# EAGLE design stm32-2inch40 (EAGLE 6.6.0)
40 pin mesonine module. 2 inch beetween pinheads.

## Sheet 1 of 2
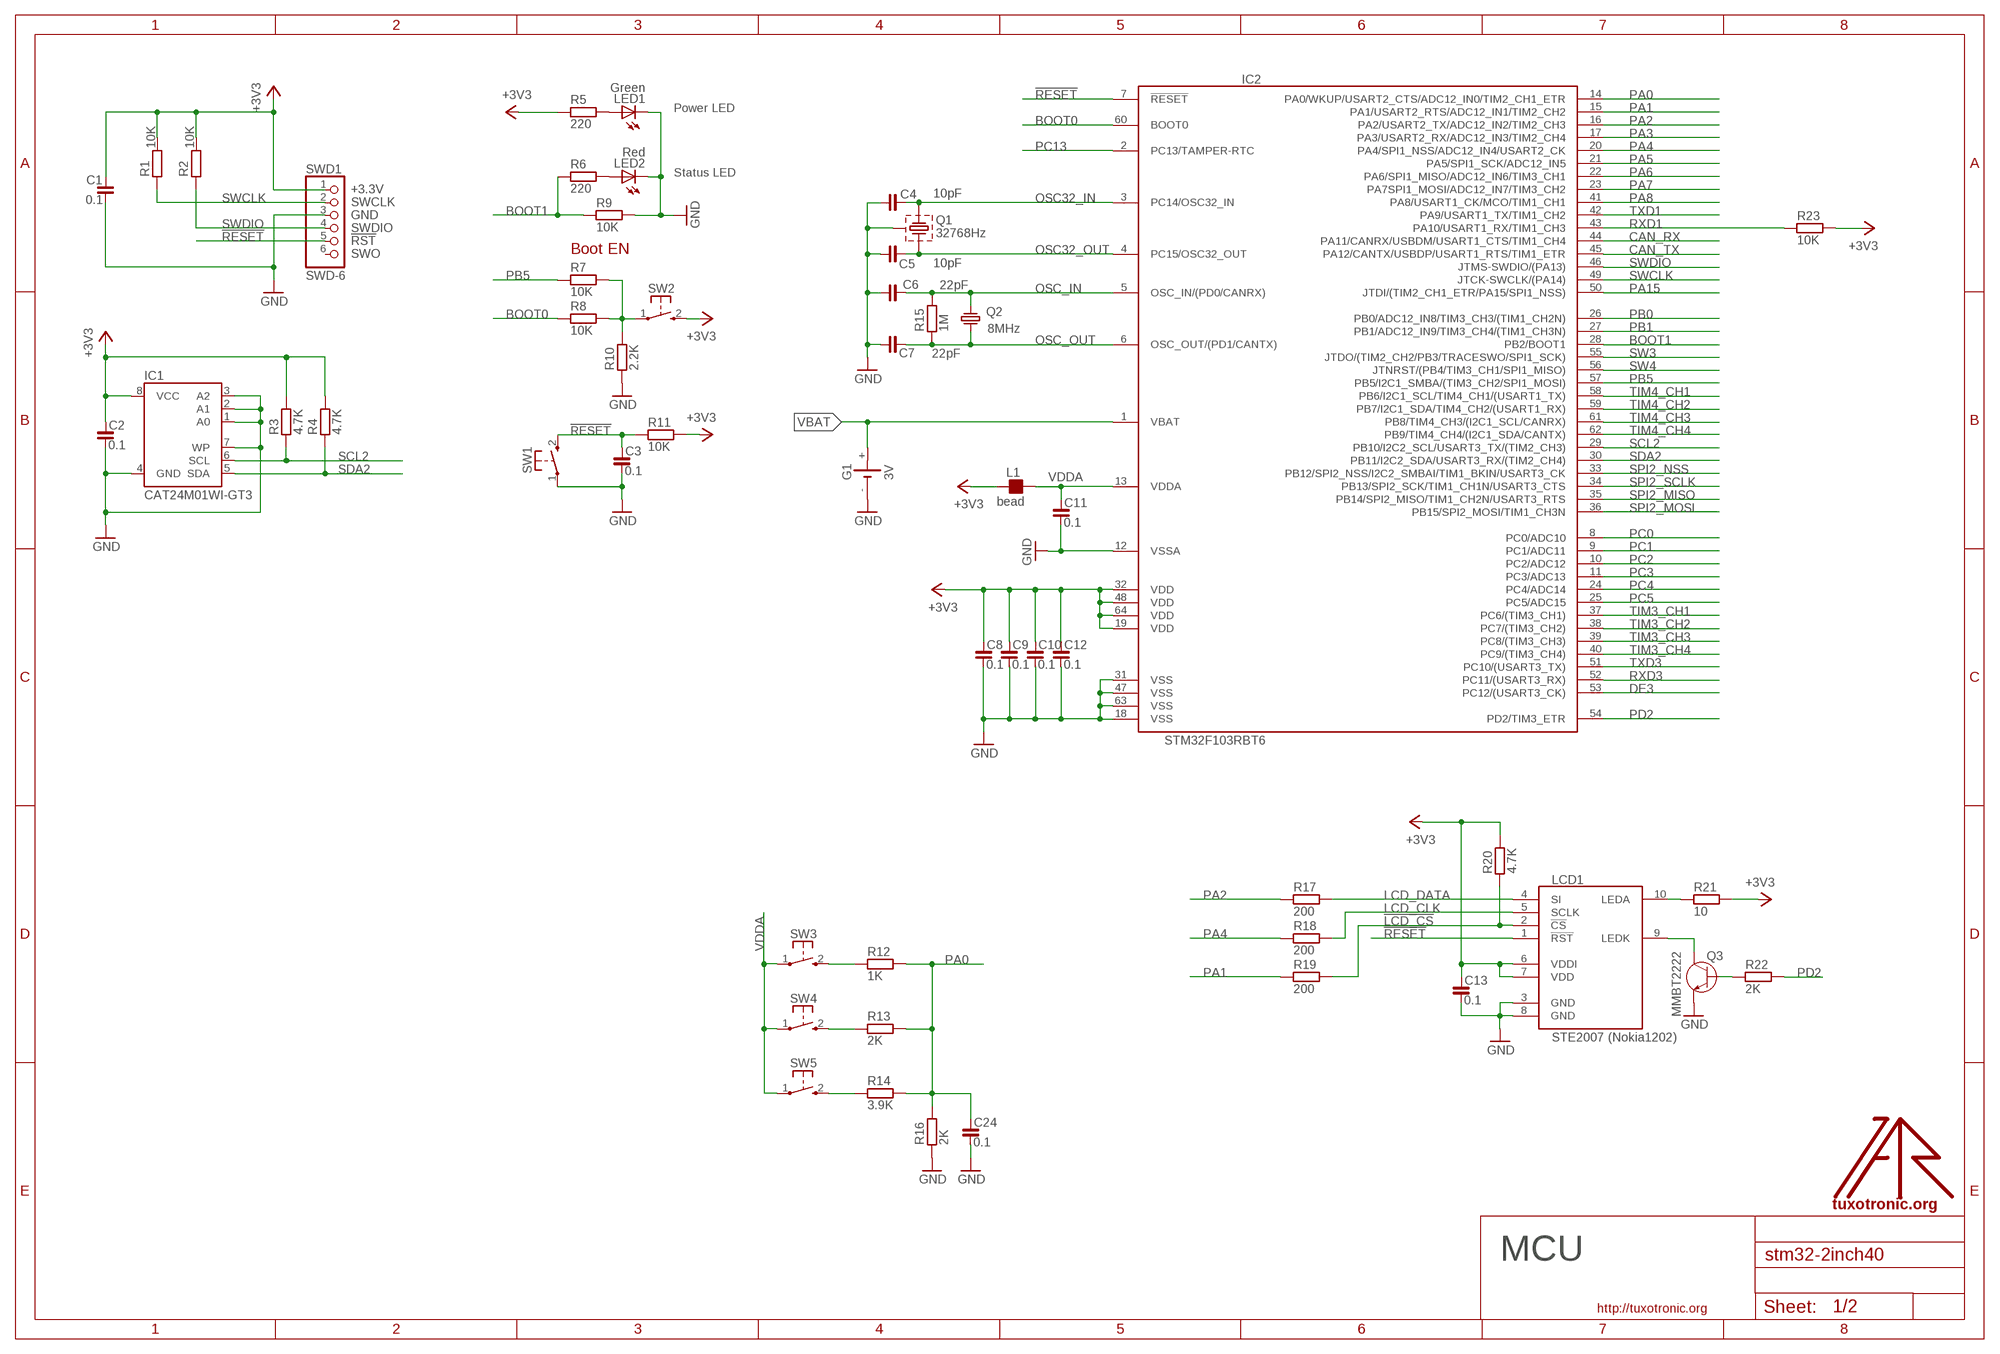
[diagram p0: schematic, sheet 1]

### Parts
C1  0.1  C_0603  [C0603]
C2  0.1  C_0603  [C0603]
C3  0.1  C_0603  [C0603]
C4  10pF  C_0603  [C0603]
C5  10pF  C_0603  [C0603]
C6  22pF  C_0603  [C0603]
C7  22pF  C_0603  [C0603]
C8  0.1  C_0603  [C0603]
C9  0.1  C_0603  [C0603]
C10  0.1  C_0603  [C0603]
C11  0.1  C_0603  [C0603]
C12  0.1  C_0603  [C0603]
C13  0.1  C_0603  [C0603]
C24  0.1  C_0603  [C0603]
G1  3V  1220SMT  [SMT1220]
IC1  CAT24M01WI-GT3  AT24C256S  [SO08]
IC2  STM32F103RBT6  STM32F103R  [TQFP64]
L1  bead  FB_0603  [L0603]
LCD1  STE2007 (Nokia1202)  LCD1202-EXT  [NOKIA1202LCD-EXT]
LED1  Green  LEDCHIP-LED0805  [CHIP-LED0805]
LED2  Red  LEDCHIP-LED0805  [CHIP-LED0805]
Q1  32768Hz  CRSTL3-  [TC38H-G]
Q2  8MHz  CRYSTAL-HC49S  [HC49/S]
Q3  MMBT2222  [SOT23]
R1  10K  R_0603  [R0603]
R2  10K  R_0603  [R0603]
R3  4.7K  R_0603  [R0603]
R4  4.7K  R_0603  [R0603]
R5  220  R_0603  [R0603]
R6  220  R_0603  [R0603]
R7  10K  R_0603  [R0603]
R8  10K  R_0603  [R0603]
R9  10K  R_0603  [R0603]
R10  2.2K  R_0603  [R0603]
R11  10K  R_0603  [R0603]
R12  1K  R_0603  [R0603]
R13  2K  R_0603  [R0603]
R14  3.9K  R_0603  [R0603]
R15  1M  R_0603  [R0603]
R16  2K  R_0603  [R0603]
R17  200  R_0603  [R0603]
R18  200  R_0603  [R0603]
R19  200  R_0603  [R0603]
R20  4.7K  R_0603  [R0603]
R21  10  R_0603  [R0603]
R22  2K  R_0603  [R0603]
R23  10K  R_0603  [R0603]
SW1  KSS-2EG4430  [KSS-2EG4430]
SW2  KSS-2EG4430  [KSS-2EG4430]
SW3  KSS-2EG4430  [KSS-2EG4430]
SW4  KSS-2EG4430  [KSS-2EG4430]
SW5  KSS-2EG4430  [KSS-2EG4430]
SWD1  SWD-6  [JTAG6PIN]
U$1  LOGO  [TT_LOGO]

### Nets
!LCD_CS: LCD1.2(!CS) R19.2 R20.1
!RESET: C3.1 IC2.7(!RESET) LCD1.1(!RST) R11.1 SW1.2(S) SWD1.5
+3V3: C1.1 C2.1 C8.1 C9.1 C10.1 C12.1 C13.1 IC1.8(VCC) IC2.19(VDD) IC2.32(VDD) IC2.48(VDD) IC2.64(VDD) L1.1 LCD1.6(VDDI) LCD1.7(VDD) R1.2 R2.2 R3.2 R4.2 R5.1 R11.2 R20.2 R21.2 R23.2 SW2.2(S) SWD1.1 ; also sheet 2
BOOT0: IC2.60(BOOT0) R8.1
BOOT1: IC2.28(PB2/BOOT1) R6.1 R9.1
CAN_RX: IC2.44(PA11/CANRX/USBDM/USART1_CTS/TIM1_CH4) ; also sheet 2
CAN_TX: IC2.45(PA12/CANTX/USBDP/USART1_RTS/TIM1_ETR) ; also sheet 2
DE3: IC2.53(PC12/(USART3_CK)) ; also sheet 2
GND: C1.2 C2.2 C3.2 C4.2 C5.2 C6.2 C7.2 C8.2 C9.2 C10.2 C11.2 C12.2 C13.2 C24.2 G1.- IC1.1(A0) IC1.2(A1) IC1.3(A2) IC1.4(GND) IC1.7(WP) IC2.12(VSSA) IC2.18(VSS) IC2.31(VSS) IC2.47(VSS) IC2.63(VSS) LCD1.3(GND) LCD1.8(GND) LED1.C LED2.C Q1.GND Q3.2(E) R9.2 R10.1 R16.1 SW1.1(P) SWD1.3 ; also sheet 2
LCD_CLK: LCD1.5(SCLK) R18.2
LCD_DATA: LCD1.4(SI) R17.2
N$3: R7.2 R8.2 R10.2 SW2.1(P)
N$13: LED1.A R5.2
N$29: LCD1.9(LEDK) Q3.3(C)
N$30: LED2.A R6.2
N$31: LCD1.10(LEDA) R21.1
N$32: Q3.1(B) R22.1
N$33: R12.1 SW3.2(S)
N$34: R13.1 SW4.2(S)
N$35: R14.1 SW5.2(S)
OSC32_IN: C4.1 IC2.3(PC14/OSC32_IN) Q1.2
OSC32_OUT: C5.1 IC2.4(PC15/OSC32_OUT) Q1.1
OSC_IN: C6.1 IC2.5(OSC_IN/(PD0/CANRX)) Q2.1 R15.2
OSC_OUT: C7.1 IC2.6(OSC_OUT/(PD1/CANTX)) Q2.2 R15.1
PA0: C24.1 IC2.14(PA0/WKUP/USART2_CTS/ADC12_IN0/TIM2_CH1_ETR) R12.2 R13.2 R14.2 R16.2 ; also sheet 2
PA1: IC2.15(PA1/USART2_RTS/ADC12_IN1/TIM2_CH2) R19.1 ; also sheet 2
PA2: IC2.16(PA2/USART2_TX/ADC12_IN2/TIM2_CH3) R17.1 ; also sheet 2
PA3: IC2.17(PA3/USART2_RX/ADC12_IN3/TIM2_CH4) ; also sheet 2
PA4: IC2.20(PA4/SPI1_NSS/ADC12_IN4/USART2_CK) R18.1 ; also sheet 2
PA5: IC2.21(PA5/SPI1_SCK/ADC12_IN5) ; also sheet 2
PA6: IC2.22(PA6/SPI1_MISO/ADC12_IN6/TIM3_CH1) ; also sheet 2
PA7: IC2.23(PA7SPI1_MOSI/ADC12_IN7/TIM3_CH2) ; also sheet 2
PA8: IC2.41(PA8/USART1_CK/MCO/TIM1_CH1) ; also sheet 2
PA15: IC2.50(JTDI/(TIM2_CH1_ETR/PA15/SPI1_NSS)) ; also sheet 2
PB0: IC2.26(PB0/ADC12_IN8/TIM3_CH3/(TIM1_CH2N)) ; also sheet 2
PB1: IC2.27(PB1/ADC12_IN9/TIM3_CH4/(TIM1_CH3N)) ; also sheet 2
PB5: IC2.57(PB5/I2C1_SMBA/(TIM3_CH2/SPI1_MOSI)) R7.1
PC0: IC2.8(PC0/ADC10) ; also sheet 2
PC1: IC2.9(PC1/ADC11) ; also sheet 2
PC2: IC2.10(PC2/ADC12) ; also sheet 2
PC3: IC2.11(PC3/ADC13) ; also sheet 2
PC4: IC2.24(PC4/ADC14) ; also sheet 2
PC5: IC2.25(PC5/ADC15) ; also sheet 2
PC13: IC2.2(PC13/TAMPER-RTC) ; also sheet 2
PD2: IC2.54(PD2/TIM3_ETR) R22.2 ; also sheet 2
RXD1: IC2.43(PA10/USART1_RX/TIM1_CH3) R23.1 ; also sheet 2
RXD3: IC2.52(PC11/(USART3_RX)) ; also sheet 2
SCL2: IC1.6(SCL) IC2.29(PB10/I2C2_SCL/USART3_TX/(TIM2_CH3)) R3.1 ; also sheet 2
SDA2: IC1.5(SDA) IC2.30(PB11/I2C2_SDA/USART3_RX/(TIM2_CH4)) R4.1 ; also sheet 2
SPI2_MISO: IC2.35(PB14/SPI2_MISO/TIM1_CH2N/USART3_RTS) ; also sheet 2
SPI2_MOSI: IC2.36(PB15/SPI2_MOSI/TIM1_CH3N) ; also sheet 2
SPI2_NSS: IC2.33(PB12/SPI2_NSS/I2C2_SMBAI/TIM1_BKIN/USART3_CK) ; also sheet 2
SPI2_SCLK: IC2.34(PB13/SPI2_SCK/TIM1_CH1N/USART3_CTS) ; also sheet 2
SW3: IC2.55(JTDO/(TIM2_CH2/PB3/TRACESWO/SPI1_SCK)) ; also sheet 2
SW4: IC2.56(JTNRST/(PB4/TIM3_CH1/SPI1_MISO)) ; also sheet 2
SWCLK: IC2.49(JTCK-SWCLK/(PA14)) R1.1 SWD1.2
SWDIO: IC2.46(JTMS-SWDIO/(PA13)) R2.1 SWD1.4
TIM3_CH1: IC2.37(PC6/(TIM3_CH1)) ; also sheet 2
TIM3_CH2: IC2.38(PC7/(TIM3_CH2)) ; also sheet 2
TIM3_CH3: IC2.39(PC8/(TIM3_CH3)) ; also sheet 2
TIM3_CH4: IC2.40(PC9/(TIM3_CH4)) ; also sheet 2
TIM4_CH1: IC2.58(PB6/I2C1_SCL/TIM4_CH1/(USART1_TX)) ; also sheet 2
TIM4_CH2: IC2.59(PB7/I2C1_SDA/TIM4_CH2/(USART1_RX)) ; also sheet 2
TIM4_CH3: IC2.61(PB8/TIM4_CH3/(I2C1_SCL/CANRX)) ; also sheet 2
TIM4_CH4: IC2.62(PB9/TIM4_CH4/(I2C1_SDA/CANTX)) ; also sheet 2
TXD1: IC2.42(PA9/USART1_TX/TIM1_CH2) ; also sheet 2
TXD3: IC2.51(PC10/(USART3_TX)) ; also sheet 2
VBAT: G1.+ IC2.1(VBAT)
VDDA: C11.1 IC2.13(VDDA) L1.2 SW3.1(P) SW4.1(P) SW5.1(P)
Unconnected: SWD1.6

### Notes on the sheet
- Power LED
- Status LED
- Boot EN
- MCU

## Sheet 2 of 2
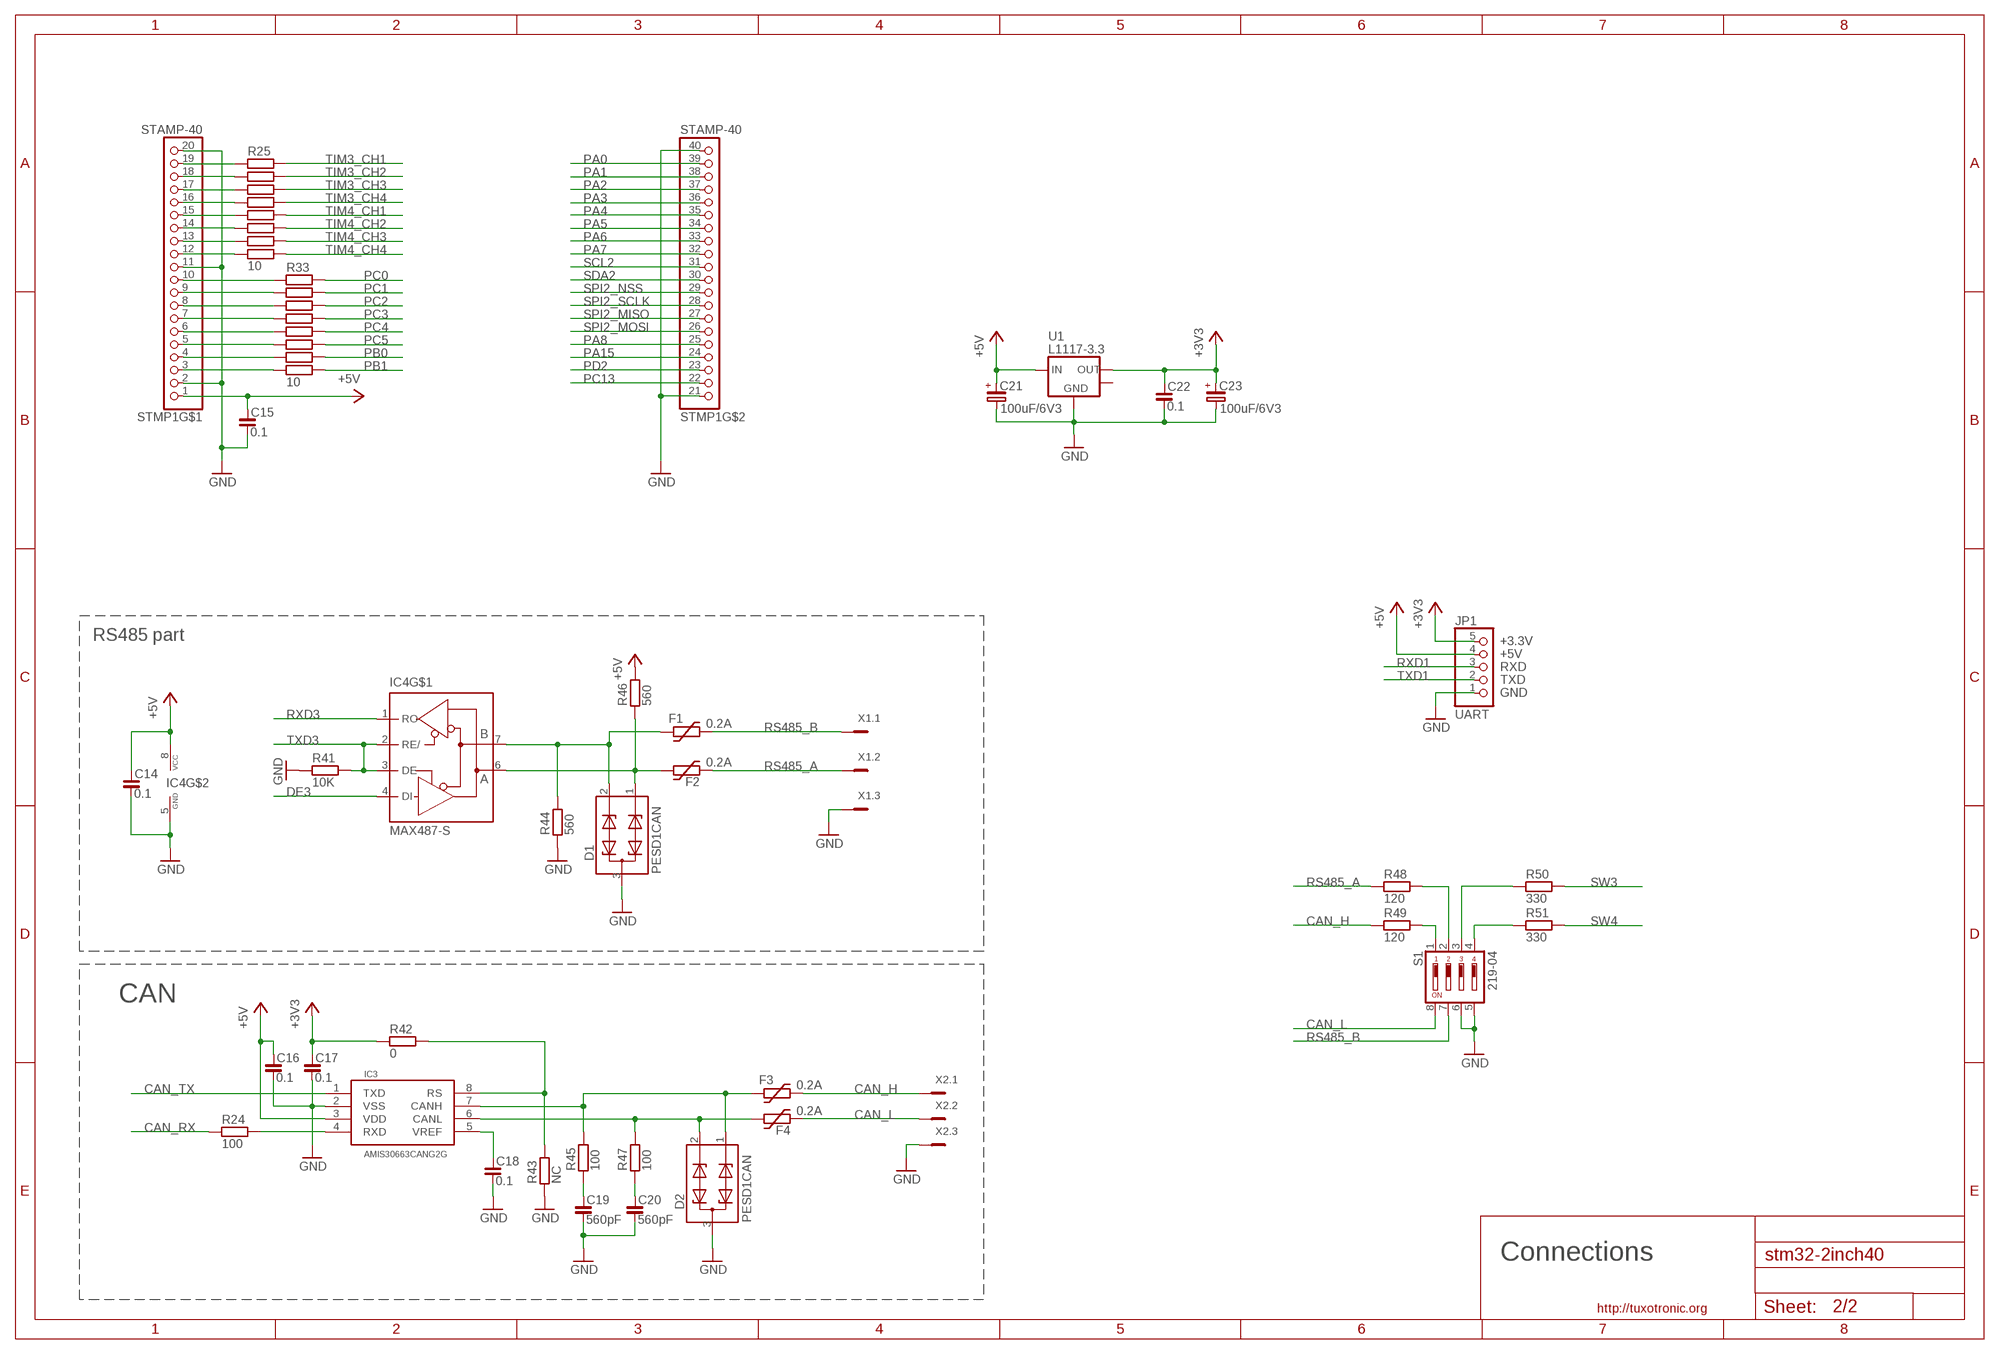
[diagram p1: schematic, sheet 2]

### Parts
C14  0.1  C_0603  [C0603]
C15  0.1  C_0805  [C0805]
C16  0.1  C_0603  [C0603]
C17  0.1  C_0603  [C0603]
C18  0.1  C_0603  [C0603]
C19  560pF  C_0603  [C0603]
C20  560pF  C_0603  [C0603]
C21  100uF/6V3  CP_SMCD  [SMC_D]
C22  0.1  C_0805  [C0805]
C23  100uF/6V3  CP_SMCD  [SMC_D]
D1  PESD1CAN  [SOT23]
D2  PESD1CAN  [SOT23]
F1  0.2A  1206L  [1206L]
F2  0.2A  1206L  [1206L]
F3  0.2A  1206L  [1206L]
F4  0.2A  1206L  [1206L]
IC3  AMIS30663CANG2G  SN65HVD230  [SO08]
IC4  MAX487-S  [SO08]
JP1  UART  UART-5_2.54  [UART_1X05]
R24  100  R_0603  [R0603]
R25  10  R_0603  [R0603]
R26  10  R_0603  [R0603]
R27  10  R_0603  [R0603]
R28  10  R_0603  [R0603]
R29  10  R_0603  [R0603]
R30  10  R_0603  [R0603]
R31  10  R_0603  [R0603]
R32  10  R_0603  [R0603]
R33  10  R_0603  [R0603]
R34  10  R_0603  [R0603]
R35  10  R_0603  [R0603]
R36  10  R_0603  [R0603]
R37  10  R_0603  [R0603]
R38  10  R_0603  [R0603]
R39  10  R_0603  [R0603]
R40  10  R_0603  [R0603]
R41  10K  R_0603  [R0603]
R42  0  R_0603  [R0603]
R43  NC  R_0603  [R0603]
R44  560  R_0603  [R0603]
R45  100  R_0603  [R0603]
R46  560  R_0603  [R0603]
R47  100  R_0603  [R0603]
R48  120  R_0805  [R0805]
R49  120  R_0805  [R0805]
R50  330  R_0603  [R0603]
R51  330  R_0603  [R0603]
S1  219-04  [CTS-219-04]
STMP1  STAMP-40  [STAMP-40]
U1  L1117-3.3  LM1117-3.3  [SOT223]
X1  MCV3  [MCV3]
X2  MCV3  [MCV3]

### Nets
+3V3: C17.1 C22.1 C23.+ JP1.5 R42.1 U1.2(OUT) ; also sheet 1
+5V: C14.1 C15.1 C16.1 C21.+ IC3.3(VDD) IC4.8(VCC) JP1.4 R46.2 STMP1.1 U1.3(IN)
CAN_CTRL: IC3.8(RS) R42.2 R43.2
CAN_H: F3.P$2 R49.1 X2.1
CAN_L: F4.P$2 S1.8 X2.2
CAN_RX: R24.1 ; also sheet 1
CAN_TX: IC3.1(TXD) ; also sheet 1
DE3: IC4.4(DI) ; also sheet 1
GND: C14.2 C15.2 C16.2 C17.2 C18.2 C19.2 C20.2 C21.- C22.2 C23.- D1.3 D2.3 IC3.2(VSS) IC4.5(GND) JP1.1 R41.1 R43.1 R44.1 S1.5 S1.6 STMP1.2 STMP1.11 STMP1.20 STMP1.21 STMP1.40 U1.1(GND) X1.3 X2.3 ; also sheet 1
N$1: C18.1 IC3.5(VREF)
N$2: R49.2 S1.1
N$6: D1.2 F1.P$1 IC4.7(B) R44.2
N$7: IC3.4(RXD) R24.2
N$8: R48.2 S1.2
N$9: R50.1 S1.3
N$10: R51.1 S1.4
N$11: R33.1 STMP1.10
N$14: R34.1 STMP1.9
N$15: R25.1 STMP1.19
N$16: R26.1 STMP1.18
N$17: R27.1 STMP1.17
N$18: R28.1 STMP1.16
N$19: R29.1 STMP1.15
N$20: R30.1 STMP1.14
N$21: R31.1 STMP1.13
N$22: R32.1 STMP1.12
N$23: R35.1 STMP1.8
N$24: R36.1 STMP1.7
N$25: R37.1 STMP1.6
N$26: R38.1 STMP1.5
N$27: R39.1 STMP1.4
N$28: R40.1 STMP1.3
N$44: D1.1 F2.P$1 IC4.6(A) R46.1
N$51: D2.1 F3.P$1 IC3.7(CANH) R45.2
N$52: D2.2 F4.P$1 IC3.6(CANL) R47.2
N$54: C20.1 R47.1
N$55: C19.1 R45.1
PA0: STMP1.39 ; also sheet 1
PA1: STMP1.38 ; also sheet 1
PA2: STMP1.37 ; also sheet 1
PA3: STMP1.36 ; also sheet 1
PA4: STMP1.35 ; also sheet 1
PA5: STMP1.34 ; also sheet 1
PA6: STMP1.33 ; also sheet 1
PA7: STMP1.32 ; also sheet 1
PA8: STMP1.25 ; also sheet 1
PA15: STMP1.24 ; also sheet 1
PB0: R39.2 ; also sheet 1
PB1: R40.2 ; also sheet 1
PC0: R33.2 ; also sheet 1
PC1: R34.2 ; also sheet 1
PC2: R35.2 ; also sheet 1
PC3: R36.2 ; also sheet 1
PC4: R37.2 ; also sheet 1
PC5: R38.2 ; also sheet 1
PC13: STMP1.22 ; also sheet 1
PD2: STMP1.23 ; also sheet 1
RS485_A: F2.P$2 R48.1 X1.2
RS485_B: F1.P$2 S1.7 X1.1
RXD1: JP1.3 ; also sheet 1
RXD3: IC4.1(RO) ; also sheet 1
SCL2: STMP1.31 ; also sheet 1
SDA2: STMP1.30 ; also sheet 1
SPI2_MISO: STMP1.27 ; also sheet 1
SPI2_MOSI: STMP1.26 ; also sheet 1
SPI2_NSS: STMP1.29 ; also sheet 1
SPI2_SCLK: STMP1.28 ; also sheet 1
SW3: R50.2 ; also sheet 1
SW4: R51.2 ; also sheet 1
TIM3_CH1: R25.2 ; also sheet 1
TIM3_CH2: R26.2 ; also sheet 1
TIM3_CH3: R27.2 ; also sheet 1
TIM3_CH4: R28.2 ; also sheet 1
TIM4_CH1: R29.2 ; also sheet 1
TIM4_CH2: R30.2 ; also sheet 1
TIM4_CH3: R31.2 ; also sheet 1
TIM4_CH4: R32.2 ; also sheet 1
TXD1: JP1.2 ; also sheet 1
TXD3: IC4.2(RE/) IC4.3(DE) R41.2 ; also sheet 1
Unconnected: U1.4(MASS)

### Notes on the sheet
- RS485 part
- CAN
- Connections

## Library data of the parts
C1-C20 C22 C24 = rc-master-smd:C_: NON-POLARIZED CAP
C21 C23 = rc-master-smd:CP_: POLARIZED CAP
D1 D2 = protect:PESD1CAN: Features Due to the integrated diode structure only one small SOT23 package is needed to protect two CAN bus lines Max. peak pulse power: PPP = 200 W at tp = 8/20 ?s Low clamping voltage: VCL = 40 V at IPP = 1 A Ultra low leakage current: IRM < 1 nA ESD protection up to 23 kV IEC 61000-4-2, level 4 (ESD) IEC 61000-4-5 (surge); IPP = 3 A at tp = 8/20 ?s Small SMD plastic package Applications CAN bus protection Automotive applications
F1-F4 = ptc-littlefuse:1206L
G1 = battery:1220SMT
IC1 = stm32-by-pb:AT24C*: 2-wire serial EEPROM
IC2 = stm32:STM32F103R: Medium-density performance line ARM-based 32-bit MCU with 64 or 128 KB Flash, USB, CAN, 7 timers, 2 ADCs, 9 communication interfaces
IC3 = interfaces:SN65HVD230: CAN PHY driver
IC4 = rs232-rs485:MAX487: RS485 TRANSEIVER
JP1 = stamp:UART-5: PIN HEADER
L1 = rc-master-smd:FB_: FERRITE BEAD
LCD1 = lcd1202:LCD1202: 1.3" b/w graphics display 96x68 pixel. From Nokia 1202 cell phone
LED1 LED2 = led:LED: LED OSRAM: - CHIPLED LG R971, LG N971, LY N971, LG Q971, LY Q971, LO R971, LY R971 LH N974, LH R974 LS Q976, LO Q976, LY Q976 LO Q996 - Hyper CHIPLED LW Q18S LB Q993, LB Q99A, LB R99A - SideLED LS A670, LO A670, LY A670, LG A670, LP A670 LB A673, LV A673, LT A673, LW A673 LH A674 LY A675 LS A676, LA A676, LO A676, LY A676, LW A676 LS A679, LY A679, LG A679 - Hyper Micro SIDELED® LS Y876, LA Y876, LO Y876, LY Y876 LT Y87S - SmartLED LW L88C, LW L88S LB L89C, LB L89S, LG L890 LS L89K, LO L89K, LY L89K LS L896, LA L896, LO L896, LY L896 - TOPLED LS T670, LO T670, LY T670, LG T670, LP T670 LSG T670, LSP T670, LSY T670, LOP T670, LYG T670 LG T671, LOG T671, LSG T671 LB T673, LV T673, LT T673, LW T673 LH T674 LS T676, LA T676, LO T676, LY T676, LB T676, LH T676, LSB T676, LW T676 LB T67C, LV T67C, LT T67C, LS T67K, LO T67K, LY T67K, LW E67C LS E67B, LA E67B, LO E67B, LY E67B, LB E67C, LV E67C, LT E67C LW T67C LS T679, LY T679, LG T679 LS T770, LO T770, LY T770, LG T770, LP T770 LB T773, LV T773, LT T773, LW T773 LH T774 LS E675, LA E675, LY E675, LS T675 LS T776, LA T776, LO T776, LY T776, LB T776 LHGB T686 LT T68C, LB T68C - Hyper Mini TOPLED® LB M676 - Mini TOPLED Santana® LG M470 LS M47K, LO M47K, LY M47K Source: http://www.osram.convergy.de - LUMILED® LXK2-PW12-R00, LXK2-PW12-S00, LXK2-PW14-U00, LXK2-PW14-V00 LXK2-PM12-R00, LXK2-PM12-S00, LXK2-PM14-U00 LXK2-PE12-Q00, LXK2-PE12-R00, LXK2-PE12-S00, LXK2-PE14-T00, LXK2-PE14-U00 LXK2-PB12-K00, LXK2-PB12-L00, LXK2-PB12-M00, LXK2-PB14-N00, LXK2-PB14-P00, LXK2-PB14-Q00 LXK2-PR12-L00, LXK2-PR12-M00, LXK2-PR14-Q00, LXK2-PR14-R00 LXK2-PD12-Q00, LXK2-PD12-R00, LXK2-PD12-S00 LXK2-PH12-R00, LXK2-PH12-S00 LXK2-PL12-P00, LXK2-PL12-Q00, LXK2-PL12-R00 Source: www.luxeon.com
Q1 = crystal:CRSTL3-
Q2 = discrete:CRYSTAL-: CRYSTAL
Q3 = semiconductor:MMBT2222: General Purpose Transistors NPN Silicon Rating MMBT2222LT1G MMBT2222ALT1G Collector-Emitter Voltage (VCEO) 30 Vdc 40 Vdc Collector-Base Voltage (VCBO) 60 Vdc 75 Vdc Emitter-Base Voltage (VEBO) 5.0 Vdc 6.0 Vdc Collector Current Continuous (IC) 600 mAdc 1100 mAdc Collector Current Peak (ICM) 600 mAdc 1100 mAdc
R1-R51 = rc-master-smd:R_: RESISTOR
S1 = switch-dil:219-04*: Surface Mount DIP Switch Series 219 SMT CTS Electronic Components Sourc: www.ctscorp.com
STMP1 = stamp:STAMP-40
SW1-SW5 = buttons:KSS-2EG4430: Size: 3x6mm Height: 5mm from PCB Rating: DC12v 50mA Travel: 0.25±0.10mm Operating Force: 180±50gf Return Force: 60gf min Contact resistance: 100m? max Insulation resistance: 100M? min Operating life?50,000 cycles
SWD1 = jtag:SWD-6: STM32Fx Discovery
U1 = vreg-linear:LM1117: Linear regulators
U$1 = logo:LOGO
X1 X2 = con-phoenix-381_l:MCV3: Mini-Combicon 3.81mm vertikal 3polig (ohne Gegenstecker)

## Net classes
0 default: width 0.1 mm, drill 0.1 mm, clearance 0.1 mm

## Board
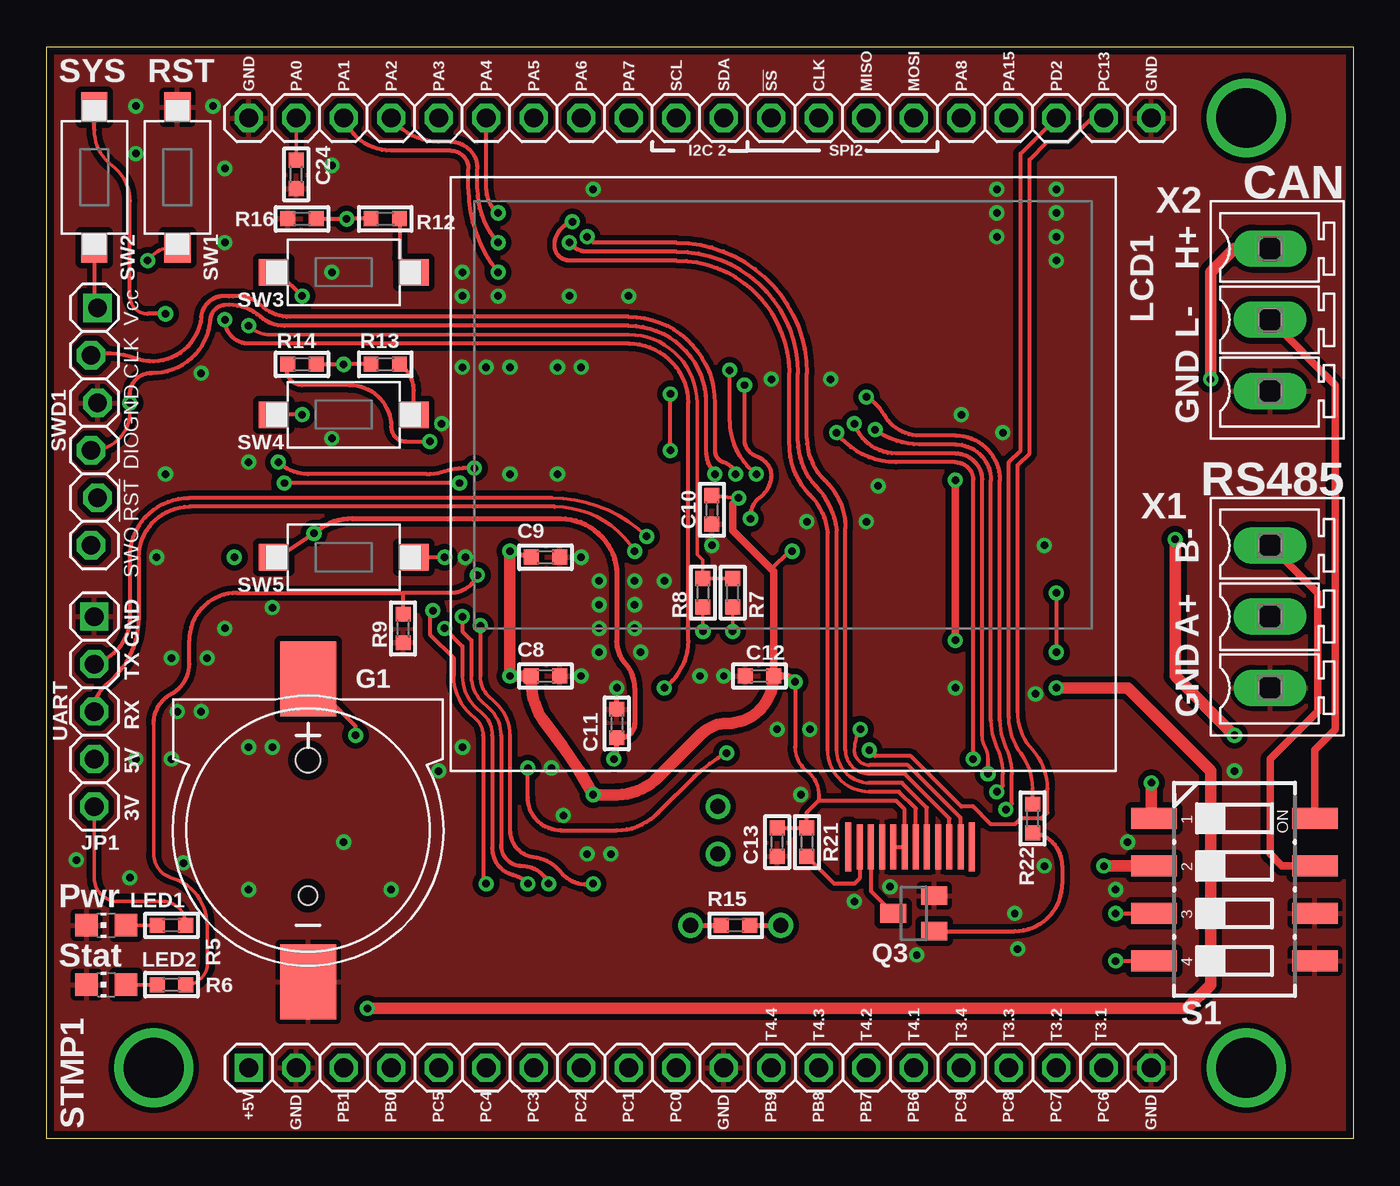
[diagram p2: board, top side]
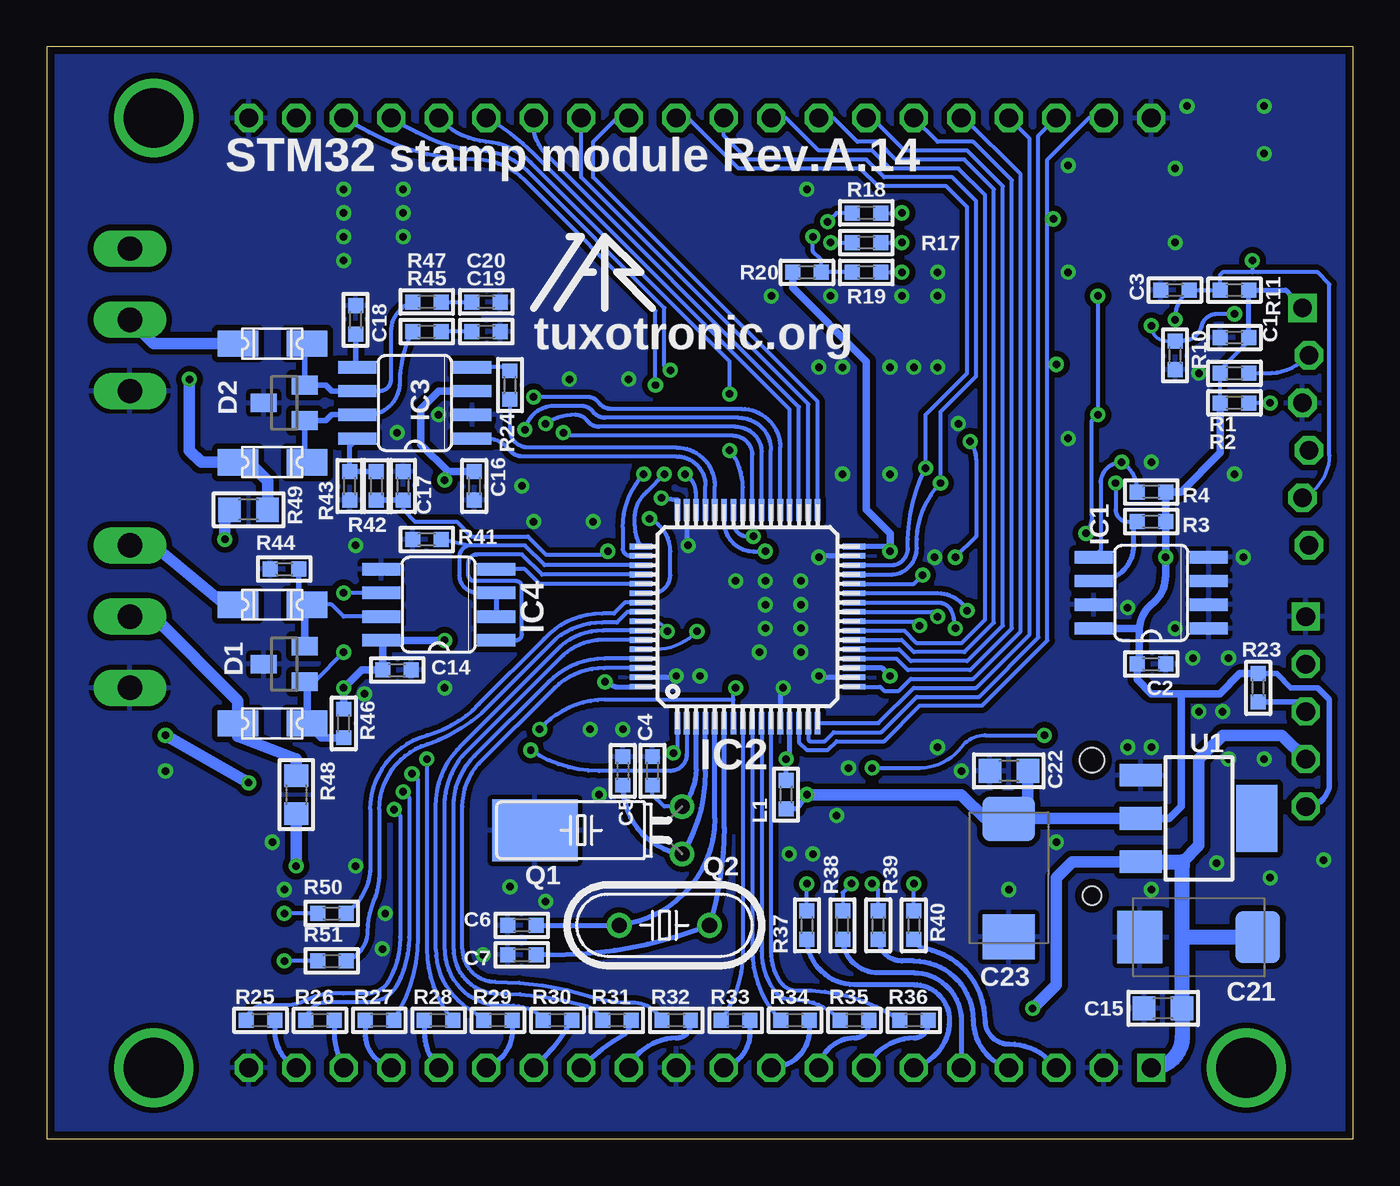
[diagram p3: board, bottom side, seen from below]

Size 69.85 x 58.42 mm. Coordinates in mm from the lower left corner, seen from the top.
Outline: 69.85,0 0,0 0,58.42 69.85,58.42 69.85,0
Copper layers (1*16): Top 0.035mm / dielectric 1.5mm / Bottom 0.035mm
Design rules "default *": minimum track width 0.16mm, minimum drill 0.4mm, track to track 0.16mm, track to pad 0.16mm, pad to pad 0.16mm, via to via 0.16mm, smd to smd 0.16mm, copper to edge 0.4mm, drill to drill 8mil, minimum pad ring 10mil, minimum via ring 8mil, stop-mask expansion 4mil, vias tented up to drill 0.6mm, thermal gap 10mil

### Footprints (pad centres in the part's own frame; a part is rotated, then mirrored left to right if it is on the bottom)
C0603 = smd 0.8 x 0.8: 1 -0.762,0; 2 0.762,0
C0805 = smd 1.2 x 1.3: 1 -1.016,0; 2 1.016,0
SMC_D = smd 2.4 x 2.8: + -3.15,0; - 3.15,0
SOT23 = smd 1 x 1.4: 1 -0.95,-1.1; 2 0.95,-1.1; 3 0,1.1
1206L = smd 2.16 x 1.4: P$1 -1.85,0; P$2 1.85,0
SMT1220 = smd 4 x 3: + -8.1,0; - 8.1,0 | hole 1: 3.5,0 | hole 1.3: -3.75,0
SO08 = smd 0.66 x 2.032: 1 -1.905,-3.073; 2 -0.635,-3.073; 3 0.635,-3.073; 4 1.905,-3.073; 5 1.905,3.073; 6 0.635,3.073; 7 -0.635,3.073; 8 -1.905,3.073
TQFP64 = smd 1.2 x 0.3: 1 -5.7,3.75; 2 -5.7,3.25; 3 -5.7,2.75; 4 -5.7,2.25; 5 -5.7,1.75; 6 -5.7,1.25; 7 -5.7,0.75; 8 -5.7,0.25; 9 -5.7,-0.25; 10 -5.7,-0.75; 11 -5.7,-1.25; 12 -5.7,-1.75; 13 -5.7,-2.25; 14 -5.7,-2.75; 15 -5.7,-3.25; 16 -5.7,-3.75; 33 5.7,-3.75; 34 5.7,-3.25; 35 5.7,-2.75; 36 5.7,-2.25; 37 5.7,-1.75; 38 5.7,-1.25; 39 5.7,-0.75; 40 5.7,-0.25; 41 5.7,0.25; 42 5.7,0.75; 43 5.7,1.25; 44 5.7,1.75; 45 5.7,2.25; 46 5.7,2.75; 47 5.7,3.25; 48 5.7,3.75 | smd 0.3 x 1.2: 17 -3.75,-5.7; 18 -3.25,-5.7; 19 -2.75,-5.7; 20 -2.25,-5.7; 21 -1.75,-5.7; 22 -1.25,-5.7; 23 -0.75,-5.7; 24 -0.25,-5.7; 25 0.25,-5.7; 26 0.75,-5.7; 27 1.25,-5.7; 28 1.75,-5.7; 29 2.25,-5.7; 30 2.75,-5.7; 31 3.25,-5.7; 32 3.75,-5.7; 49 3.75,5.7; 50 3.25,5.7; 51 2.75,5.7; 52 2.25,5.7; 53 1.75,5.7; 54 1.25,5.7; 55 0.75,5.7; 56 0.25,5.7; 57 -0.25,5.7; 58 -0.75,5.7; 59 -1.25,5.7; 60 -1.75,5.7; 61 -2.25,5.7; 62 -2.75,5.7; 63 -3.25,5.7; 64 -3.75,5.7
UART_1X05 = drill 1 square: 1 -5.08,0 | drill 1 octagon: 2 -2.54,0; 3 0,0; 4 2.54,0; 5 5.08,0
L0603 = smd 0.8 x 0.8: 1 -0.762,0; 2 0.762,0
NOKIA1202LCD-EXT = smd 0.32 x 2.6: 0 -10.09,23.114; 11 -3.49,23.114 | smd 0.32 x 2.4: 1 -9.49,23.114; 2 -8.89,23.114; 3 -8.29,23.114; 4 -7.69,23.114; 5 -7.09,23.114; 6 -6.49,23.114; 7 -5.89,23.114; 8 -5.29,23.114; 9 -4.69,23.114; 10 -4.09,23.114
CHIP-LED0805 = smd 1.2 x 1.2: A 0,-1.05; C 0,1.05
TC38H-G = drill 0.8: 1 -1.27,0; 2 1.27,0 | smd 3.302 x 4.572: GND 0,7.874
HC49/S = drill 0.813: 1 -2.413,0; 2 2.413,0
R0603 = smd 0.8 x 0.8: 1 -0.762,0; 2 0.762,0
R0805 = smd 1.2 x 1.3: 1 -1.016,0; 2 1.016,0
CTS-219-04 = smd 1.13 x 2.44: 1 -3.81,-4.3; 2 -1.27,-4.3; 3 1.27,-4.3; 4 3.81,-4.3; 5 3.81,4.3; 6 1.27,4.3; 7 -1.27,4.3; 8 -3.81,4.3
STAMP-40 = drill 1 square: 1 -24.13,-25.4 | drill 1 octagon: 2 -21.59,-25.4; 3 -19.05,-25.4; 4 -16.51,-25.4; 5 -13.97,-25.4; 6 -11.43,-25.4; 7 -8.89,-25.4; 8 -6.35,-25.4; 9 -3.81,-25.4; 10 -1.27,-25.4; 11 1.27,-25.4; 12 3.81,-25.4; 13 6.35,-25.4; 14 8.89,-25.4; 15 11.43,-25.4; 16 13.97,-25.4; 17 16.51,-25.4; 18 19.05,-25.4; 19 21.59,-25.4; 20 24.13,-25.4; 21 24.13,25.4; 22 21.59,25.4; 23 19.05,25.4; 24 16.51,25.4; 25 13.97,25.4; 26 11.43,25.4; 27 8.89,25.4; 28 6.35,25.4; 29 3.81,25.4; 30 1.27,25.4; 31 -1.27,25.4; 32 -3.81,25.4; 33 -6.35,25.4; 34 -8.89,25.4; 35 -11.43,25.4; 36 -13.97,25.4; 37 -16.51,25.4; 38 -19.05,25.4; 39 -21.59,25.4; 40 -24.13,25.4
KSS-2EG4430 = smd 1.6 x 1.4: 1 -3.75,0; 2 3.75,0
JTAG6PIN = drill 1 square: 1 -6.35,0.178 | drill 1 octagon: 2 -3.81,-0.178; 3 -1.27,0.178; 4 1.27,-0.178; 5 3.81,0.178; 6 6.35,-0.178
SOT223 = smd 1.219 x 2.235: 1 -2.311,-3.099; 2 0,-3.099; 3 2.311,-3.099 | smd 3.6 x 2.2: 4 0,3.099
MCV3 = drill 1.3 pad 1.905 long: 1 -3.81,0; 2 0,0; 3 3.81,0

### Placement (x,y rotation side)
C1  6.35,42.86 180 bottom
C2  10.79,25.4 0 bottom
C3  9.53,45.4 180 bottom
C4  37.47,19.68 90 bottom
C5  39.05,19.68 90 bottom
C6  44.45,11.43 180 bottom
C7  44.45,9.84 180 bottom
C8  26.67,24.77 0 top
C9  26.67,31.11 0 top
C10  35.56,33.66 270 top
C11  30.48,22.22 90 top
C12  38.1,24.77 180 top
C13  39.05,15.88 270 top
C14  51.12,25.08 0 bottom
C15  10.16,6.98 180 bottom
C16  46.99,34.93 270 bottom
C17  50.8,34.93 90 bottom
C18  53.34,43.82 90 bottom
C19  46.35,43.18 0 bottom
C20  46.35,44.77 0 bottom
C21  8.26,10.79 180 bottom
C22  18.41,19.68 180 bottom
C23  18.41,13.97 270 bottom
C24  13.34,51.59 270 top
D1  57.15,25.4 90 bottom
D2  57.15,39.37 90 bottom
F1  57.78,28.57 180 bottom
F2  57.78,22.22 180 bottom
F3  57.78,36.2 180 bottom
F4  57.78,42.55 180 bottom
G1  13.97,16.51 270 top
IC1  10.79,29.21 90 bottom
IC2  32.38,27.94 90 bottom
IC3  50.16,39.37 90 bottom
IC4  48.9,28.57 90 bottom
JP1  2.54,22.86 270 top
L1  30.32,18.41 90 bottom
LCD1  39.37,38.74 180 top
LED1  3.17,11.43 90 top
LED2  3.17,8.26 90 top
Q1  35.88,16.51 90 bottom
Q2  36.83,11.43 0 bottom
Q3  46.35,12.06 90 top
R1  6.35,40.96 180 bottom
R2  6.35,39.37 180 bottom
R3  10.79,33.02 0 bottom
R4  10.79,34.61 0 bottom
R5  6.67,11.43 180 top
R6  6.67,8.26 180 top
R7  36.67,29.21 90 top
R8  35.08,29.21 90 top
R9  19.05,27.3 270 top
R10  9.53,41.91 90 bottom
R11  6.35,45.4 0 bottom
R12  18.1,49.21 180 top
R13  18.1,41.43 180 top
R14  13.65,41.43 0 top
R15  36.83,11.43 0 top
R16  13.65,49.21 0 top
R17  26.04,47.94 180 bottom
R18  26.04,49.53 180 bottom
R19  26.04,46.36 180 bottom
R20  29.21,46.36 180 bottom
R21  40.64,15.88 90 top
R22  52.7,17.14 90 top
R23  5.08,24.13 90 bottom
R24  45.09,40.32 90 bottom
R25  58.42,6.35 180 bottom
R26  55.24,6.35 180 bottom
R27  52.07,6.35 0 bottom
R28  48.9,6.35 0 bottom
R29  45.72,6.35 180 bottom
R30  42.55,6.35 180 bottom
R31  39.37,6.35 180 bottom
R32  36.2,6.35 180 bottom
R33  33.02,6.35 180 bottom
R34  29.84,6.35 180 bottom
R35  26.67,6.35 180 bottom
R36  23.5,6.35 180 bottom
R37  29.21,11.43 90 bottom
R38  27.3,11.43 90 bottom
R39  25.4,11.43 90 bottom
R40  23.5,11.43 90 bottom
R41  49.53,32.07 0 bottom
R42  52.23,34.93 90 bottom
R43  53.66,34.93 90 bottom
R44  57.15,30.48 0 bottom
R45  49.53,43.18 180 bottom
R46  53.98,22.22 90 bottom
R47  49.53,44.77 180 bottom
R48  56.52,18.41 270 bottom
R49  59.05,33.66 180 bottom
R50  54.61,12.06 0 bottom
R51  54.61,9.53 0 bottom
S1  63.5,13.33 270 top
STMP1  34.92,29.21 0 top
SW1  6.99,51.44 270 top
SW2  2.54,51.44 270 top
SW3  15.88,46.36 0 top
SW4  15.88,38.74 0 top
SW5  15.88,31.11 0 top
SWD1  2.54,38.1 270 top
U1  8.26,17.14 270 bottom
U$1  40.01,46.99 0 bottom
X1  65.41,27.94 270 top
X2  65.41,43.82 270 top

### Tracks (layer width: path | path; a pad name or v marks a point on that pad's centre or on a via)
!LCD_CS  (via drill 0.4)
  Top 0.2: 43.97,19.53 arc-90 42.7,20.8
  Top 0.203: LCD1.2 48.26,17.14 45.88,19.53 43.97,19.53 | 42.7,20.8 42.7,32.7 arc46 41.59,35.24 arc-46 40.64,37.47 40.64,40.96 arc90 33.66,47.94 29.21,47.94 v28.89,48.26
  Bottom 0.203: R19.2 R20.1 28.45,47.02 28.89,47.47 v28.89,48.26
!RESET  (via drill 0.4)
  Top 0.2: 43.97,20 arc-90 43.18,20.8 arc-32 v43.5,21.91 | 6.73,47.69 arc55 v5.4,46.99
  Top 0.203: v9.53,43.82 arc90 10.79,42.55 31.11,42.55 arc-90 34.29,39.37 34.29,26.67 arc-53 v33.02,24.13 | SW1.2 6.73,47.69 | LCD1.1 48.86,17.18 46.04,20 43.97,20
  Bottom 0.2: 1.27,36.54 arc64 SWD1.5
  Bottom 0.203: 1.27,36.54 1.27,45.72 1.91,46.36 5.4,46.36 | IC2.7 33.13,23.5 | 33.13,23.5 33.13,24.02 v33.02,24.13 | v9.53,43.82 arc51 C3.1 R11.1 7.11,46.23 6.99,46.36 5.4,46.36 | v5.4,46.99 5.4,46.36 | 33.13,23.5 40.01,23.5 arc-49 v43.5,21.91
  Bottom 0.254: R11.1 | 6.99,45.53 R11.1
+3V3  (via drill 0.4)
  Top 0.2: 40.01,20.95 arc53 40.64,19.68 arc-53 41.27,18.41 | JP1.5 2.54,13.97 arc90 3.81,12.7 6.35,12.7 arc-85 R5.1
  Top 0.203: SW2.2 2.54,44.58 SWD1.1 | LCD1.7 LCD1.6 45.86,17.62 45.38,18.1 41.27,18.1 | 41.27,18.1 40.64,17.46 R21.2 C13.1 | v40.01,24.45 40.01,20.95 | 41.27,18.41 41.27,18.1 | C10.1 v36.99,34.29 | v39.85,31.43 39.69,31.43 38.73,30.48
  Top 0.254: v24.77,31.43 C9.1
  Top 0.406: v40.01,24.45 arc53 39.37,24.77 C12.1 38.86,30.35 38.73,30.48 36.67,32.54 36.67,33.97 v36.99,34.29
  Top 0.61: v24.77,31.43 v24.77,24.77 C8.1 25.91,24.42 arc38 26.67,22.22 arc-9 v29.21,18.41 | v29.21,18.41 | C12.1 arc-91 36.35,22.22 arc45 35,21.67 32.7,19.37 arc-46 30.48,18.41 v29.21,18.41
  Bottom 0.203: 5.59,42.67 7.11,41.15 R1.2 R2.2 | C17.1 50.8,33.66 50.16,33.02 47.94,33.02 47.15,32.23 44.13,32.23 43.18,31.27 40.01,31.27 v39.85,31.43
  Bottom 0.254: IC2.64 39.43,24.19 v40.01,24.45 | IC2.19 25.19,25.19 v24.77,24.77 | IC2.32 24.82,31.69 v24.77,31.43 | IC2.48 36.13,34.19 v36.99,34.29 | L1.1 29.72,17.65 v29.21,18.41 | 11.43,25.53 C2.1 | 5.59,42.67 C1.1 R11.2 3.62,45.4 SWD1.1
  Bottom 0.305: R42.1 C17.1 | JP1.5 arc-90 1.27,19.05 1.27,23.5 1.91,24.13 3.33,24.13 4.1,24.89 R23.2
  Bottom 0.406: IC1.8 11.43,27.3 | 11.43,27.3 11.43,25.53 | 11.43,27.3 arc51 10.79,28.57 arc-52 10.03,30.13 v10.03,31.11 R3.2 R4.2 9.21,34.61 7.11,36.7 R2.2 | U1.2 9.84,17.14 9.21,17.78 9.21,23.81 | 9.21,23.81 7.14,23.81 6.06,24.89 R23.2 | 9.21,23.81 10.79,23.81 11.56,24.57 C2.1 | R20.2 29.97,45.53 26.04,41.59 26.04,33.66 24.77,32.38 v24.77,31.43
  Bottom 0.61: v29.21,18.41 20.95,18.41 19.68,17.14 18.39,17.14 | U1.2 18.39,17.14 | C22.1 17.4,18.14 18.39,17.14 | 18.39,17.14 C23.+
+5V  (via drill 0.4)
  Top 0.406: v48.58,26.67 v48.58,35.24
  Top 0.61: v17.14,6.98 60.96,6.98 62.23,8.26 62.23,19.68 57.78,24.13 v53.98,24.13
  Bottom 0.406: IC3.3 48.9,40.01 49.85,39.05 49.85,37.15 48.39,35.69 | 48.39,35.69 C16.1 | R46.2 v53.98,24.13 53.02,25.08 C14.1 51.88,26.58 IC4.8 v48.58,26.67 | v48.58,35.24 48.58,35.5 48.39,35.69
  Bottom 0.61: JP1.4 3.81,21.59 6.99,21.59 8.26,20.32 8.26,15.7 9.12,14.83 | U1.3 15.01,14.83 15.88,13.97 15.88,8.26 v17.14,6.98
  Bottom 0.813: 9.14,10.79 C15.1 9.14,5.46 arc90 STMP1.1 | 9.14,10.79 9.14,14.22 9.12,14.83 U1.3 | C21.+ 9.14,10.79
BOOT0  (via drill 0.4)
  Top 0.2: v35.08,27.15 R8.1 | R8.1
  Bottom 0.2: IC2.60 37.31,26.19 arc-46 v35.08,27.15
BOOT1  (via drill 0.4)
  Top 0.2: 5.71,22.22 5.71,15.24 arc74 6.67,13.97 arc-74 8.57,11.43 8.57,9.21 arc-82 R6.1
  Top 0.203: 19.05,29.21 10.16,29.21 arc90 7.62,26.67 7.62,25.4 arc-62 6.67,23.81 arc62 5.71,22.22 | R9.1 19.05,29.21 | 19.05,29.21 21.59,29.21 arc67 v23.02,30.16
  Bottom 0.203: IC2.28 23.49,29.69 v23.02,30.16
CAN_CTRL
  Bottom 0.254: R43.2 53.66,37.05 IC3.8
  Bottom 0.305: R43.2 R42.2
CAN_H  (via drill 0.4)
  Top 0.61: v62.23,40.64 62.23,46.36 63.5,47.62 X2.1
  Bottom 0.61: R49.1 58.04,35.18 59.05,36.2 F3.P$2 61.59,36.2 62.23,36.83 v62.23,40.64
CAN_L
  Top 0.406: S1.8 67.8,20.81 68.9,21.91 68.9,40.32 X2.2
  Bottom 0.61: F4.P$2 64.14,42.55 X2.2
CAN_RX
  Bottom 0.203: IC2.44 34.13,34.93 arc-90 36.2,36.99 44.13,36.99 arc90 45.09,37.94 R24.1
CAN_TX
  Bottom 0.203: IC2.45 34.63,34.93 arc-91 36.2,36.51 44.45,36.51 arc53 45.09,36.83 arc-53 46.35,37.47 IC3.1
DE3
  Bottom 0.203: IC2.53 43.49,29.69 44.29,30.48 IC4.4
GND  (via drill 0.4)
  Top 0.254: C11.2 v30.48,24.13
  Bottom 0.254: IC2.31 28.5,31.19 v28.57,31.11 | IC2.47 35.63,31.82 v35.56,31.75 | IC2.63 36.27,24.69 v36.2,24.77 | IC2.18 28.5,24.69 v28.57,24.77 | IC2.12 30.64,23.97 v30.48,24.13
  other vias: 8.89,55.24 4.76,52.71 4.76,55.25 27.62,17.3 12.06,20.96 53.97,48.26 40.32,18.41 46.51,9.84 10.79,20.96 8.57,25.72 9.53,27.3 12.06,28.42 48.9,38.74 63.5,19.68 8.26,40.96 6.35,35.56 5.87,31.11 22.38,31.11 24.77,35.56 50.8,48.26 53.34,14.61 57.15,13.33 57.78,15.88 51.75,12.06 51.91,10.16 44.45,34.93 51.12,37.78 53.34,31.75 48.58,24.13 39.05,21.91 45.09,13.49 43.18,12.7 9.53,47.94 9.53,51.91 15.24,52.07 22.23,46.36 10.79,36.2 6.67,25.72 6.99,22.86 8.26,22.86 4.76,20.32 6.67,20.32 26.99,19.84 22.23,20.95 20.96,19.68 18.42,13.33 15.88,15.88 7.3,14.76 10.8,13.33 30.16,15.24 28.89,15.24 53.97,46.99 53.97,49.53 50.8,49.53 50.8,50.8 53.97,50.8 15.24,46.36 15.24,37.47 21.11,38.26 29.53,29.84 31.43,29.84 29.53,28.57 29.53,27.3 29.53,26.04 31.43,28.57 31.43,27.3 31.75,26.04 23.5,41.28 27.3,41.28 27.94,45.09 24.13,45.09 31.11,45.09 24.77,41.28 22.23,45.09 22.23,41.28 28.57,41.28 29.21,50.8 40.8,21.91 43.81,33.02 40.64,33.02 38.73,40.64 52.86,23.81 41.91,40.64 27.3,35.56 34.92,24.77 33.02,29.84 1.59,14.92 4.45,13.97
  pour Bottom (isolate 0.305): -0.64,-0.64 70.48,-0.64 70.48,59.05 -0.64,59.05
  pour Top (isolate 0.305): -1.27,-1.27 71.12,-1.27 71.12,59.69 -1.27,59.69
LCD_CLK  (via drill 0.4)
  Top 0.2: 43.97,18.57 arc-90 41.75,20.8
  Top 0.203: 41.75,20.8 41.75,32.38 arc40 40.8,34.45 arc-45 39.69,37.15 39.69,40.96 arc90 33.66,46.99 27.94,46.99 arc-90 27.15,47.78 arc-74 v28.1,49.05 | LCD1.5 46.46,17.68 45.56,18.57 43.97,18.57
  Bottom 0.203: R18.2 27.62,49.53 v28.1,49.05
LCD_DATA  (via drill 0.4)
  Top 0.2: 43.97,19.05 arc-90 42.23,20.8
  Top 0.203: 42.23,20.8 42.23,32.54 arc37 41.12,34.93 arc-44 40.16,37.31 40.16,40.96 arc90 33.66,47.47 28.89,47.47 arc-53 v27.94,47.94 | LCD1.4 47.06,17.71 45.72,19.05 43.97,19.05
  Bottom 0.203: v27.94,47.94 R17.2
N$1
  Bottom 0.305: C18.1 53.34,41.38 IC3.5
N$2  (via drill 0.4)
  Top 0.61: v60.33,32.07 60.33,24.77 v63.5,21.59 | v59.05,19.05 59.05,17.29 S1.1
  Bottom 0.61: v60.33,32.07 60.33,33.4 R49.2 | v63.5,21.59 v59.05,19.05
N$3  (via drill 0.4)
  Top 0.2: R7.2 R8.2 35.08,30.96 34.77,31.27 34.77,39.37 arc90 31.11,43.02 11.91,43.02 arc-46 v10.79,43.5 | 4.45,45.09 arc90 5.4,44.13 | 4.45,50.17 arc53 3.49,52.07 arc-53 2.54,53.98
  Top 0.203: 6.03,44.13 5.4,44.13 | 4.45,45.09 4.45,50.17 | 2.54,53.98 SW2.1
  Top 0.254: v6.35,44.13 6.03,44.13
  Bottom 0.2: R10.2 9.97,42.67 arc90 v10.79,43.5
  Bottom 0.203: 9.56,42.67 R10.2 9.05,42.7 arc-72 8.1,43.5 arc74 7.3,44.13 arc3 v6.35,44.13
N$4  (via drill 3.2)
  other vias: 64.14,54.61
N$5  (via drill 3.2)
  other vias: 5.71,3.81
N$6
  Bottom 0.203: IC4.7 53.98,27.94 54.61,28.57 F1.P$1
  Bottom 0.254: D1.2 55.56,26.35
  Bottom 0.305: R44.2 56.39,29.03 F1.P$1
  Bottom 0.406: D1.2 56.05,28.46 F1.P$1
N$7
  Bottom 0.203: IC3.4 45.28,41.28 R24.2
N$8  (via drill 0.4)
  Top 0.61: v56.52,14.61 S1.2
  Bottom 0.61: R48.2 v56.52,14.61
N$9  (via drill 0.4)
  Top 0.203: v57.15,12.06 S1.3
  Bottom 0.203: R50.1 v57.15,12.06
N$10  (via drill 0.4)
  Top 0.203: v57.15,9.53 S1.4
  Bottom 0.203: R51.1 v57.15,9.53
N$11
  Bottom 0.254: R33.1 32.26,5.68 arc73 STMP1.10
N$12  (via drill 3.2)
  other vias: 64.14,3.81
N$13
  Top 0.2: LED1.A R5.2
N$14
  Bottom 0.254: R34.1 29.08,5.84 arc90 STMP1.9
N$15
  Bottom 0.254: R25.1 57.66,5.75 arc-61 STMP1.19
N$16
  Bottom 0.254: R26.1 54.48,5.75 arc-29 STMP1.18
N$17
  Bottom 0.254: R27.1 52.83,5.68 arc-73 STMP1.17
N$18
  Bottom 0.254: R28.1 49.66,5.68 arc-44 STMP1.16
N$19
  Bottom 0.254: R29.1 44.96,5.84 arc69 STMP1.15
N$20
  Bottom 0.254: R30.1 arc17 43.21,4.41 STMP1.14
N$21
  Bottom 0.254: R31.1 arc61 39.05,5.56 arc-15 41.15,3.94 STMP1.13
N$22
  Bottom 0.254: R32.1 arc103 36.2,5.4 arc-64 STMP1.12
N$23
  Bottom 0.254: R35.1 arc103 26.67,5.4 arc-80 STMP1.8
N$24
  Bottom 0.254: R36.1 arc103 23.5,5.4 arc-64 STMP1.7
N$25
  Bottom 0.254: R37.1 arc-87 26.67,8.26 23.5,8.26 arc90 21.59,6.35 arc74 STMP1.6
N$26
  Bottom 0.254: R38.1 arc-86 25.4,8.89 23.5,8.89 arc90 20.95,6.35 STMP1.5
N$27
  Bottom 0.254: R39.1 arc-84 24.13,9.53 23.5,9.53 arc90 20.32,6.35 arc-74 STMP1.4
N$28
  Bottom 0.254: R40.1 arc-57 22.86,10.16 arc80 19.68,6.35 arc-90 18.41,5.08 arc53 STMP1.3
N$29
  Top 0.203: LCD1.9 44.06,13.26 Q3.3
N$30
  Top 0.2: LED2.A R6.2
N$31
  Top 0.203: LCD1.10 43.46,13.93 43.18,13.65 42.1,13.65 R21.1
N$32
  Top 0.203: Q3.1 51.76,11.12 arc90 54.29,13.65 54.29,14.61 arc84 R22.1
N$33
  Top 0.203: R12.1 18.86,47.12 SW3.2
N$34
  Top 0.203: SW4.2 19.62,40.03 arc57 R13.1
N$35  (via drill 0.4)
  Top 0.203: SW5.2 v21.27,31.11 | v20.48,37.31 19.21,37.31 arc-90 18.41,38.1 arc90 16.19,40.32 13.65,40.32 arc-111 R14.1
  Bottom 0.203: v21.27,31.11 20.16,32.23 20.16,36.35 arc-37 v20.48,37.31
N$44  (via drill 0.4)
  Top 0.203: v53.98,29.21 v53.98,26.04
  Bottom 0.203: 55.81,22.1 F2.P$1 | D1.1 55.56,24.45 v53.98,26.04 | IC4.6 v53.98,29.21
  Bottom 0.406: D1.1 55.94,24.34 F2.P$1 55.17,21.46 R46.1
N$51
  Bottom 0.203: IC3.7 52.7,38.74 arc-90 50.96,40.48 arc28 R45.2
  Bottom 0.305: F3.P$1 56.05,35.99 D2.1 54.92,38.42 54.61,38.74 IC3.7
N$52
  Bottom 0.203: IC3.6 52.07,40.01 arc-90 51.44,40.64 51.44,43.18 arc72 R47.2
  Bottom 0.305: F4.P$1 56.05,42.76 D2.2 54.92,40.32 54.61,40.01 IC3.6
N$54
  Bottom 0.203: R47.1 C20.1
N$55
  Bottom 0.203: C19.1 R45.1
OSC32_IN
  Bottom 0.203: Q1.2 36.83,17.78 37.47,18.41 C4.1
  Bottom 0.254: IC2.3 35.13,19.79 arc41 Q1.2
OSC32_OUT
  Bottom 0.254: IC2.4 34.63,19.66 arc31 Q1.1 arc82 39.05,18.89 C5.1
OSC_IN
  Top 0.254: R15.2 Q2.1
  Bottom 0.254: IC2.5 34.13,17.14 arc84 Q2.1 C6.1
OSC_OUT
  Top 0.254: Q2.2 R15.1
  Bottom 0.254: IC2.6 33.63,16.66 arc17 Q2.2 arc21 42.99,9.84 C7.1
PA0  (via drill 0.4)
  Top 0.2: STMP1.39 C24.1
  Top 0.203: R14.2 v15.88,41.43 R13.2 | R16.2 v16.03,49.21 R12.2
  Bottom 0.203: IC2.14 29.64,21.22 29.21,20.8 28.1,20.8 27.62,21.27 25.08,21.27 23.18,23.18 19.84,23.18 16.35,26.67 16.35,41.43 | 16.35,41.43 16.35,49.37 | 16.35,49.37 16.35,52.39 14.13,54.61 STMP1.39 | v15.88,41.43 16.35,41.43 | v16.03,49.21 16.19,49.21 16.35,49.37
PA1  (via drill 0.4)
  Top 0.203: STMP1.38 arc69 18.41,52.86 21.59,52.86 arc-90 22.54,51.91 22.54,50.8 arc39 v24.13,46.36
  Bottom 0.203: IC2.15 29.14,21.36 29.05,21.27 28.26,21.27 27.78,21.75 25.24,21.75 23.34,23.65 20,23.65 16.83,26.83 16.83,53.66 STMP1.38 | R19.1 v24.13,46.36
PA2  (via drill 0.4)
  Top 0.203: STMP1.37 arc53 20.95,53.34 21.59,53.34 arc-90 23.02,51.91 23.02,50.8 arc43 v24.13,47.94
  Bottom 0.203: IC2.16 25.39,22.24 23.5,24.13 20.16,24.13 17.3,26.99 17.3,53.5 STMP1.37 | R17.1 v24.13,47.94
PA3
  Bottom 0.203: IC2.17 25.3,24.19 25.08,23.97 24.29,23.97 23.65,24.61 20.32,24.61 17.78,27.15 17.78,51.59 20.8,54.61 STMP1.36
PA4  (via drill 0.4)
  Top 0.203: STMP1.35 23.5,50.8 arc53 v24.13,49.53
  Bottom 0.203: STMP1.35 22.23,53.34 20.32,53.34 18.26,51.28 18.26,27.3 20.48,25.08 23.81,25.08 24.42,25.69 IC2.20 | R18.1 v24.13,49.53
PA5
  Bottom 0.203: IC2.21 24.29,26.19 23.65,25.56 20.64,25.56 18.73,27.46 18.73,50.96 20.64,52.86 23.97,52.86 25.72,54.61 STMP1.34
PA6
  Bottom 0.203: IC2.22 24.15,26.69 23.5,26.04 20.8,26.04 19.21,27.62 19.21,50.8 20.8,52.39 24.45,52.39 25.4,53.34 26.51,53.34 27.78,54.61 STMP1.33
PA7
  Bottom 0.203: IC2.23 24.02,27.19 23.34,26.51 20.95,26.51 19.68,27.78 19.68,50.48 21.11,51.91 24.77,51.91 25.72,52.86 28.57,52.86 30.32,54.61 STMP1.32
PA8  (via drill 0.4)
  Top 0.203: v33.34,36.83 v33.34,39.85
  Bottom 0.203: IC2.41 32.63,34.86 arc-39 v33.34,36.83 | v33.34,39.85 33.34,41.59 43.97,52.23 arc-40 46.35,53.34 arc43 STMP1.25
PA15  (via drill 0.4)
  Top 0.203: v36.51,41.12 36.51,38.42 arc53 v37.94,35.56
  Bottom 0.203: v36.51,41.12 arc90 36.83,41.43 36.83,44.45 44.13,51.75 arc-43 46.67,52.86 arc22 49.37,53.5 arc8 STMP1.24 | IC2.50 38.65,31.19 arc90 39.05,31.59 39.05,32.7 arc43 v37.94,35.56
PB0  (via drill 0.4)
  Top 0.2: 23.81,21.59 arc53 23.18,22.86 arc-53 22.23,24.77
  Top 0.203: v21.27,27.3 22.23,26.35 22.23,24.77 | 23.81,21.59 23.81,15.56 arc76 24.92,14.13 arc-33 v25.72,13.65
  Bottom 0.203: IC2.26 22.18,28.69 arc76 21.43,28.1 arc4 v21.27,27.3 | R39.2 25.4,13.33 v25.72,13.65
PB1  (via drill 0.4)
  Top 0.2: 23.34,21.59 arc53 22.86,22.54 arc-53 21.75,24.77
  Top 0.203: v20.64,28.26 20.48,28.1 20.48,26.99 21.75,25.72 21.75,24.77 | 23.34,21.59 23.34,13.81 v23.5,13.65
  Bottom 0.203: IC2.27 22.2,29.19 arc61 v20.64,28.26 | R40.2 v23.5,13.65
PB5  (via drill 0.4)
  Top 0.2: v36.67,27.15 R7.1
  Bottom 0.2: IC2.57 37.53,27.69 arc65 v36.67,27.15
PC0
  Bottom 0.203: IC2.8 32.63,10.07 arc34 R33.2
PC1
  Bottom 0.203: IC2.9 32.13,10.07 arc-45 R34.2 30.61,6.48
PC2
  Bottom 0.203: IC2.10 31.64,10.04 arc-36 30.96,7.94 arc-55 30,7.46 arc49 R35.2
PC3
  Bottom 0.203: 24.26,6.48 R36.2 arc-38 29.69,7.94 arc58 30.64,8.41 arc34 31.14,10.02 IC2.11
PC4  (via drill 0.4)
  Top 0.2: 24.77,21.59 arc53 23.81,23.5 arc-53 23.18,24.77
  Top 0.203: v23.18,27.46 23.18,24.77 | 24.77,21.59 24.77,16.51 arc83 26.04,15.08 arc-45 27.46,14.29 arc63 v29.21,13.65
  Bottom 0.203: IC2.24 23.4,27.69 v23.18,27.46 | R37.2 v29.21,13.65
PC5  (via drill 0.4)
  Top 0.2: 24.29,21.59 arc53 23.5,23.18 arc-57 22.7,24.92
  Top 0.203: v22.23,27.94 22.23,27.15 22.7,26.67 22.7,24.92 22.7,24.77 | 24.29,21.59 24.29,15.72 arc90 25.4,14.61 arc-67 v26.83,13.65
  Bottom 0.203: IC2.25 22.48,28.19 v22.23,27.94 | v26.83,13.65 27.3,13.18 R38.2
PC13  (via drill 0.4)
  Top 0.2: 51.91,22.86 arc42 52.7,20.8 arc-42 53.5,18.73
  Top 0.203: STMP1.22 55.88,54.61 54.61,53.34 53.5,53.34 52.55,52.39 52.55,36.67 51.91,36.04 51.91,22.86 | v43.97,20.8 44.29,20.48 46.2,20.48 48.9,17.78 49.53,17.78 50.48,16.83 51.75,16.83 52.07,17.14 53.18,17.14 53.5,17.46 53.5,18.73
  Bottom 0.203: IC2.2 35.63,20.56 arc90 36.51,19.68 40.32,19.68 arc34 v43.97,20.8
PD2  (via drill 0.4)
  Top 0.2: 52.7,18.73 arc37 52.07,20.64 arc-37 51.44,22.54
  Top 0.203: v37.31,40.32 37.31,37.31 arc61 37.94,36.51 arc-33 38.58,36.04 arc-37 38.73,35.56 arc-53 38.1,34.29 arc60 v37.62,33.18 | R22.2 52.7,18.73 | 51.44,22.54 51.44,36.2 52.07,36.83 52.07,52.71 STMP1.23
  Bottom 0.203: v37.31,40.32 37.31,44.29 44.29,51.28 arc-45 46.99,52.39 arc26 51.91,53.5 arc5 STMP1.23 | IC2.54 37.48,29.19 arc-90 36.51,30.16 36.51,31.43 arc-65 v37.62,33.18
RS485_A
  Bottom 0.61: R48.1 56.52,20.32 59.63,21.54 F2.P$2 59.63,23.44 64.14,27.94 X1.2
RS485_B
  Top 0.406: S1.7 66.04,14.61 65.41,15.24 65.41,20.32 67.94,22.86 67.94,29.21 X1.1
  Bottom 0.61: F1.P$2 60.33,28.57 64.14,31.75 X1.1
RXD1  (via drill 0.4)
  Top 0.2: 27.15,33.81 arc-58 v31.43,31.43
  Top 0.203: 27.15,33.81 7.62,33.81 arc90 4.92,31.11 4.92,27.94 arc-51 3.17,24.29 arc54 JP1.3
  Bottom 0.203: IC2.43 33.63,33 arc-90 32.07,31.43 v31.43,31.43
  Bottom 0.305: R23.1 3.05,23.37 JP1.3
RXD3
  Bottom 0.203: IC4.1 44.77,26.67 arc-90 44.45,26.99 44.45,29.53 arc-90 44.77,29.84 46.99,29.84 arc90 47.31,30.16 47.31,30.8 arc90 46.83,31.27 44.45,31.27 43.37,30.19 IC2.52
SCL2  (via drill 0.4)
  Top 0.203: v22.07,35.08 v12.7,35.08
  Bottom 0.203: IC2.29 24.74,30.19 arc-90 23.34,31.59 23.34,32.07 arc42 v22.07,35.08 22.07,38.89 20.16,40.8 20.16,50.17 21.43,51.44 25.08,51.44 26.04,52.39 32.38,52.39 33.66,53.66 STMP1.31 | v12.7,35.08 12.7,33.66 arc-90 12.06,33.02 R3.1
  Bottom 0.254: R3.1 11.75,32.83 11.75,31.75 arc96 IC1.6
SDA2  (via drill 0.4)
  Top 0.203: v22.86,35.88 22.23,35.88 arc19 21.27,35.72 arc-19 20.32,35.56 13.97,35.56 arc-44 v12.38,36.2
  Bottom 0.203: IC2.30 24.71,30.69 arc-90 23.81,31.59 23.81,32.07 arc26 v22.86,35.88 22.86,38.74 20.64,40.96 20.64,49.85 21.75,50.96 25.4,50.96 26.35,51.91 32.86,51.91 35.56,54.61 STMP1.30 | R4.1 11.56,34.74 arc-59 v12.38,36.2 arc-90 13.49,35.08 13.49,31.49 IC1.5
  Bottom 0.254: IC1.5 13.34,31.11
SPI2_MISO
  Bottom 0.203: IC2.35 29.64,39.16 43.18,52.71 arc53 STMP1.27
SPI2_MOSI
  Bottom 0.203: IC2.36 30.14,39.03 43.81,52.71 arc-16 STMP1.26
SPI2_NSS
  Bottom 0.203: IC2.33 28.64,39.43 40.64,51.44 40.64,53.34 39.37,54.61 STMP1.29
SPI2_SCLK
  Bottom 0.203: IC2.34 29.14,39.3 41.27,51.44 STMP1.28
SW3
  Bottom 0.203: IC2.55 38.94,28.69 39.53,28.1 40.16,28.1 arc-47 43.26,26.75 46.75,23.26 arc31 49.53,21.59 arc-74 52.55,17.62 52.55,14.64 arc54 R50.2
SW4
  Bottom 0.203: IC2.56 38.8,28.19 39.37,27.62 40.16,27.62 arc-39 42.62,26.75 46.12,23.26 arc28 49.53,21.11 arc-72 52.07,17.62 52.07,14.29 arc23 52.39,12.7 arc-23 52.7,11.11 arc72 R51.2
SWCLK  (via drill 0.4)
  Top 0.203: SWD1.2 arc-33 4.76,41.75 arc22 5.71,41.59 arc83 8.26,43.97 arc-87 9.53,45.09 arc5 10.16,45.09 arc-46 11.43,44.61 arc44 13.02,43.97 31.11,43.97 arc-90 35.72,39.37 35.72,36.83 arc74 36.2,36.2 arc-57 v36.83,35.56
  Bottom 0.203: R1.1 4.64,40.96 arc-46 SWD1.2 | v36.83,35.56 37.78,34.61 arc-48 38.42,33.18 38.42,32.82 arc-33 IC2.49
SWDIO  (via drill 0.4)
  Top 0.2: 4.45,38.86 arc-90 SWD1.4
  Top 0.203: 4.45,38.86 v4.45,39.37 arc-18 4.45,40.01 arc-82 5.59,40.96 arc87 8.73,43.82 arc-82 9.53,44.61 arc-45 11.43,43.97 arc41 12.7,43.5 31.11,43.5 arc-90 35.24,39.37 35.24,36.83 arc41 v35.72,35.56
  Bottom 0.203: IC2.46 35.13,34.5 arc-58 v35.72,35.56 | v4.45,39.37 R2.1
TIM3_CH1  (via drill 0.4)
  Top 0.2: 51.59,19.53 arc25 51.28,20.95 arc-25 50.96,22.38
  Top 0.203: v51.28,17.62 51.59,17.94 51.59,19.53 | 50.96,22.38 50.96,35.24 arc90 48.58,37.62 46.67,37.62 arc-61 44.77,38.74 arc31 v43.81,39.69
  Bottom 0.203: IC2.37 30.64,36.99 arc-90 32.7,39.05 39.69,39.05 arc53 40.32,39.37 arc-53 40.96,39.69 v43.81,39.69 | v51.28,17.62 50.96,17.3 50.96,10.79 arc30 51.59,8.41 arc61 52.7,7.78 arc-1 54.61,7.78 arc-27 55.88,7.46 arc27 57.15,7.14 arc1 58.26,7.14 arc-83 R25.2
TIM3_CH2  (via drill 0.4)
  Top 0.2: 51.12,19.53 arc25 50.8,20.95 arc-25 50.48,22.38
  Top 0.203: v50.8,18.57 51.12,18.89 51.12,19.53 | 50.48,22.38 50.48,35.24 arc90 48.58,37.15 46.67,37.15 arc-37 v44.29,37.94
  Bottom 0.203: IC2.38 31.14,36.85 arc-90 32.86,38.58 40.01,38.58 arc53 40.64,38.89 arc-53 41.27,39.21 42.7,39.21 arc-77 v44.29,37.94 | v50.8,18.57 50.48,18.26 50.48,10.79 arc28 51.12,8.26 arc62 52.7,7.3 54.93,7.3 arc-83 R26.2
TIM3_CH3  (via drill 0.4)
  Top 0.2: 50.32,20.32 arc28 50.16,20.95 arc-28 50.01,21.59
  Top 0.203: v50.32,19.53 50.32,20.32 | 50.01,21.59 50.01,35.24 arc90 48.58,36.67 45.4,36.67 arc-71 v43.18,38.26
  Bottom 0.203: IC2.39 31.64,36.72 arc-90 33.02,38.1 40.32,38.1 arc53 40.96,38.42 arc-53 41.59,38.74 arc-33 v43.18,38.26 | v50.32,19.53 50.01,19.21 50.01,10.79 arc33 R27.2
TIM3_CH4  (via drill 0.4)
  Top 0.203: v49.53,20.32 49.53,35.24 arc90 48.58,36.2 45.4,36.2 arc-53 v42.23,37.78
  Bottom 0.203: IC2.40 32.13,36.58 arc-90 33.18,37.62 42.07,37.62 v42.23,37.78 | v49.53,20.32 49.53,10.16 arc-40 R28.2
TIM4_CH1
  Bottom 0.203: IC2.58 40.12,27.19 arc-41 42.39,26.35 47.62,21.11 arc-46 49.05,17.78 49.05,10.16 arc-58 47.31,6.98 arc10 R29.2
TIM4_CH2
  Bottom 0.203: IC2.59 40.14,26.69 arc-43 42.23,25.88 47.62,20.48 arc-39 48.58,17.78 48.58,10.16 arc-93 45.4,7.14 arc20 44.13,6.98 arc41 R30.2
TIM4_CH3
  Bottom 0.203: IC2.61 40.03,25.69 arc-45 43.02,24.45 46.99,20.48 arc-45 48.1,17.78 48.1,10.16 arc-90 45.72,7.78 arc16 41.12,7.14 arc46 R31.2
TIM4_CH4
  Bottom 0.203: IC2.62 40.06,25.19 arc-44 42.7,24.13 46.75,20.08 arc-42 47.62,17.78 47.62,10.16 arc-90 45.88,8.41 arc18 40.8,7.62 arc-19 38.58,7.3 arc64 R32.2
TXD1  (via drill 0.4)
  Top 0.2: 26.99,34.29 arc-44 v32.07,32.23
  Top 0.203: 26.99,34.29 7.62,34.29 arc90 4.45,31.11 4.45,27.94 arc-74 JP1.2
  Bottom 0.203: IC2.42 33.13,32.98 arc-90 32.38,32.23 v32.07,32.23
TXD3
  Bottom 0.203: IC4.3 46.83,29.21 arc90 47.78,30.16 47.78,31.11 arc74 47.31,31.75 | IC2.51 43.23,30.69 44.29,31.75 47.31,31.75 | 47.31,31.75 R41.2
  Bottom 0.254: IC4.3 IC4.2
VBAT  (via drill 0.4)
  Top 0.203: 25.72,20.16 v25.72,19.84 25.72,18.26 arc90 27.46,16.51 30.48,16.51 arc46 32.7,17.46 34.61,19.37 arc-18 v36.35,20.64 | v16.51,21.59 16.51,22.07 G1.+
  Bottom 0.2: 23.18,19.84 arc-53 20.95,20.95 arc53 19.68,21.59
  Bottom 0.203: IC2.1 36.13,20.86 v36.35,20.64 | 19.68,21.59 v16.51,21.59 | v25.72,19.84 23.18,19.84
  Bottom 0.254: 36.15,22.22 IC2.1
VDDA  (via drill 0.4)
  Top 0.203: SW3.1 12.44,46.3 v13.65,45.09 | v13.65,38.74 SW4.1 | SW5.1 12.38,31.11 v14.29,32.38
  Top 0.254: v30.32,20.32 30.48,20.48 C11.1 arc103 31.43,22.22 31.43,24.13 arc41 30.96,25.4 arc-41 30.48,26.67 30.48,30.16 arc90 27.46,33.18 16.35,33.18 arc42 v14.29,32.38
  Bottom 0.203: v13.65,45.09 v13.65,38.74 13.97,38.42 13.97,33.34 arc37 v14.29,32.38
  Bottom 0.254: IC2.13 30.14,20.66 v30.32,20.32 L1.2

### Text on the board
tPlace: SYS | RST | GND | PA0 | PA1 | PA2 | PA3 | PA4 | PA5 | PA6 | PA7 | SCL | SDA | !SS | CLK | MISO | MOSI | PA8 | PA15 | PD2 | PC13 | GND | I2C 2 | SPI2 | CAN | H+ | L- | GND | RS485 | B- | A+ | GND | UART | Pwr | Stat | T4.4 | T4.3 | T4.2 | T4.1 | T3.4 | T3.3 | T3.2 | T3.1 | +5V | GND | PB1 | PB0 | PC5 | PC4 | PC3 | PC2 | PC1 | PC0 | GND | PB9 | PB8 | PB7 | PB6 | PC9 | PC8 | PC7 | PC6 | GND
bPlace: STM32 stamp module Rev.A.14 | tuxotronic.org